# EasyEDA schematic SCH.json
TITLE: Sheet_1; REV: 1.0; Date: 2022-06-12; Sheet: 1/1; Drawn By: tirion; Company: Your Company
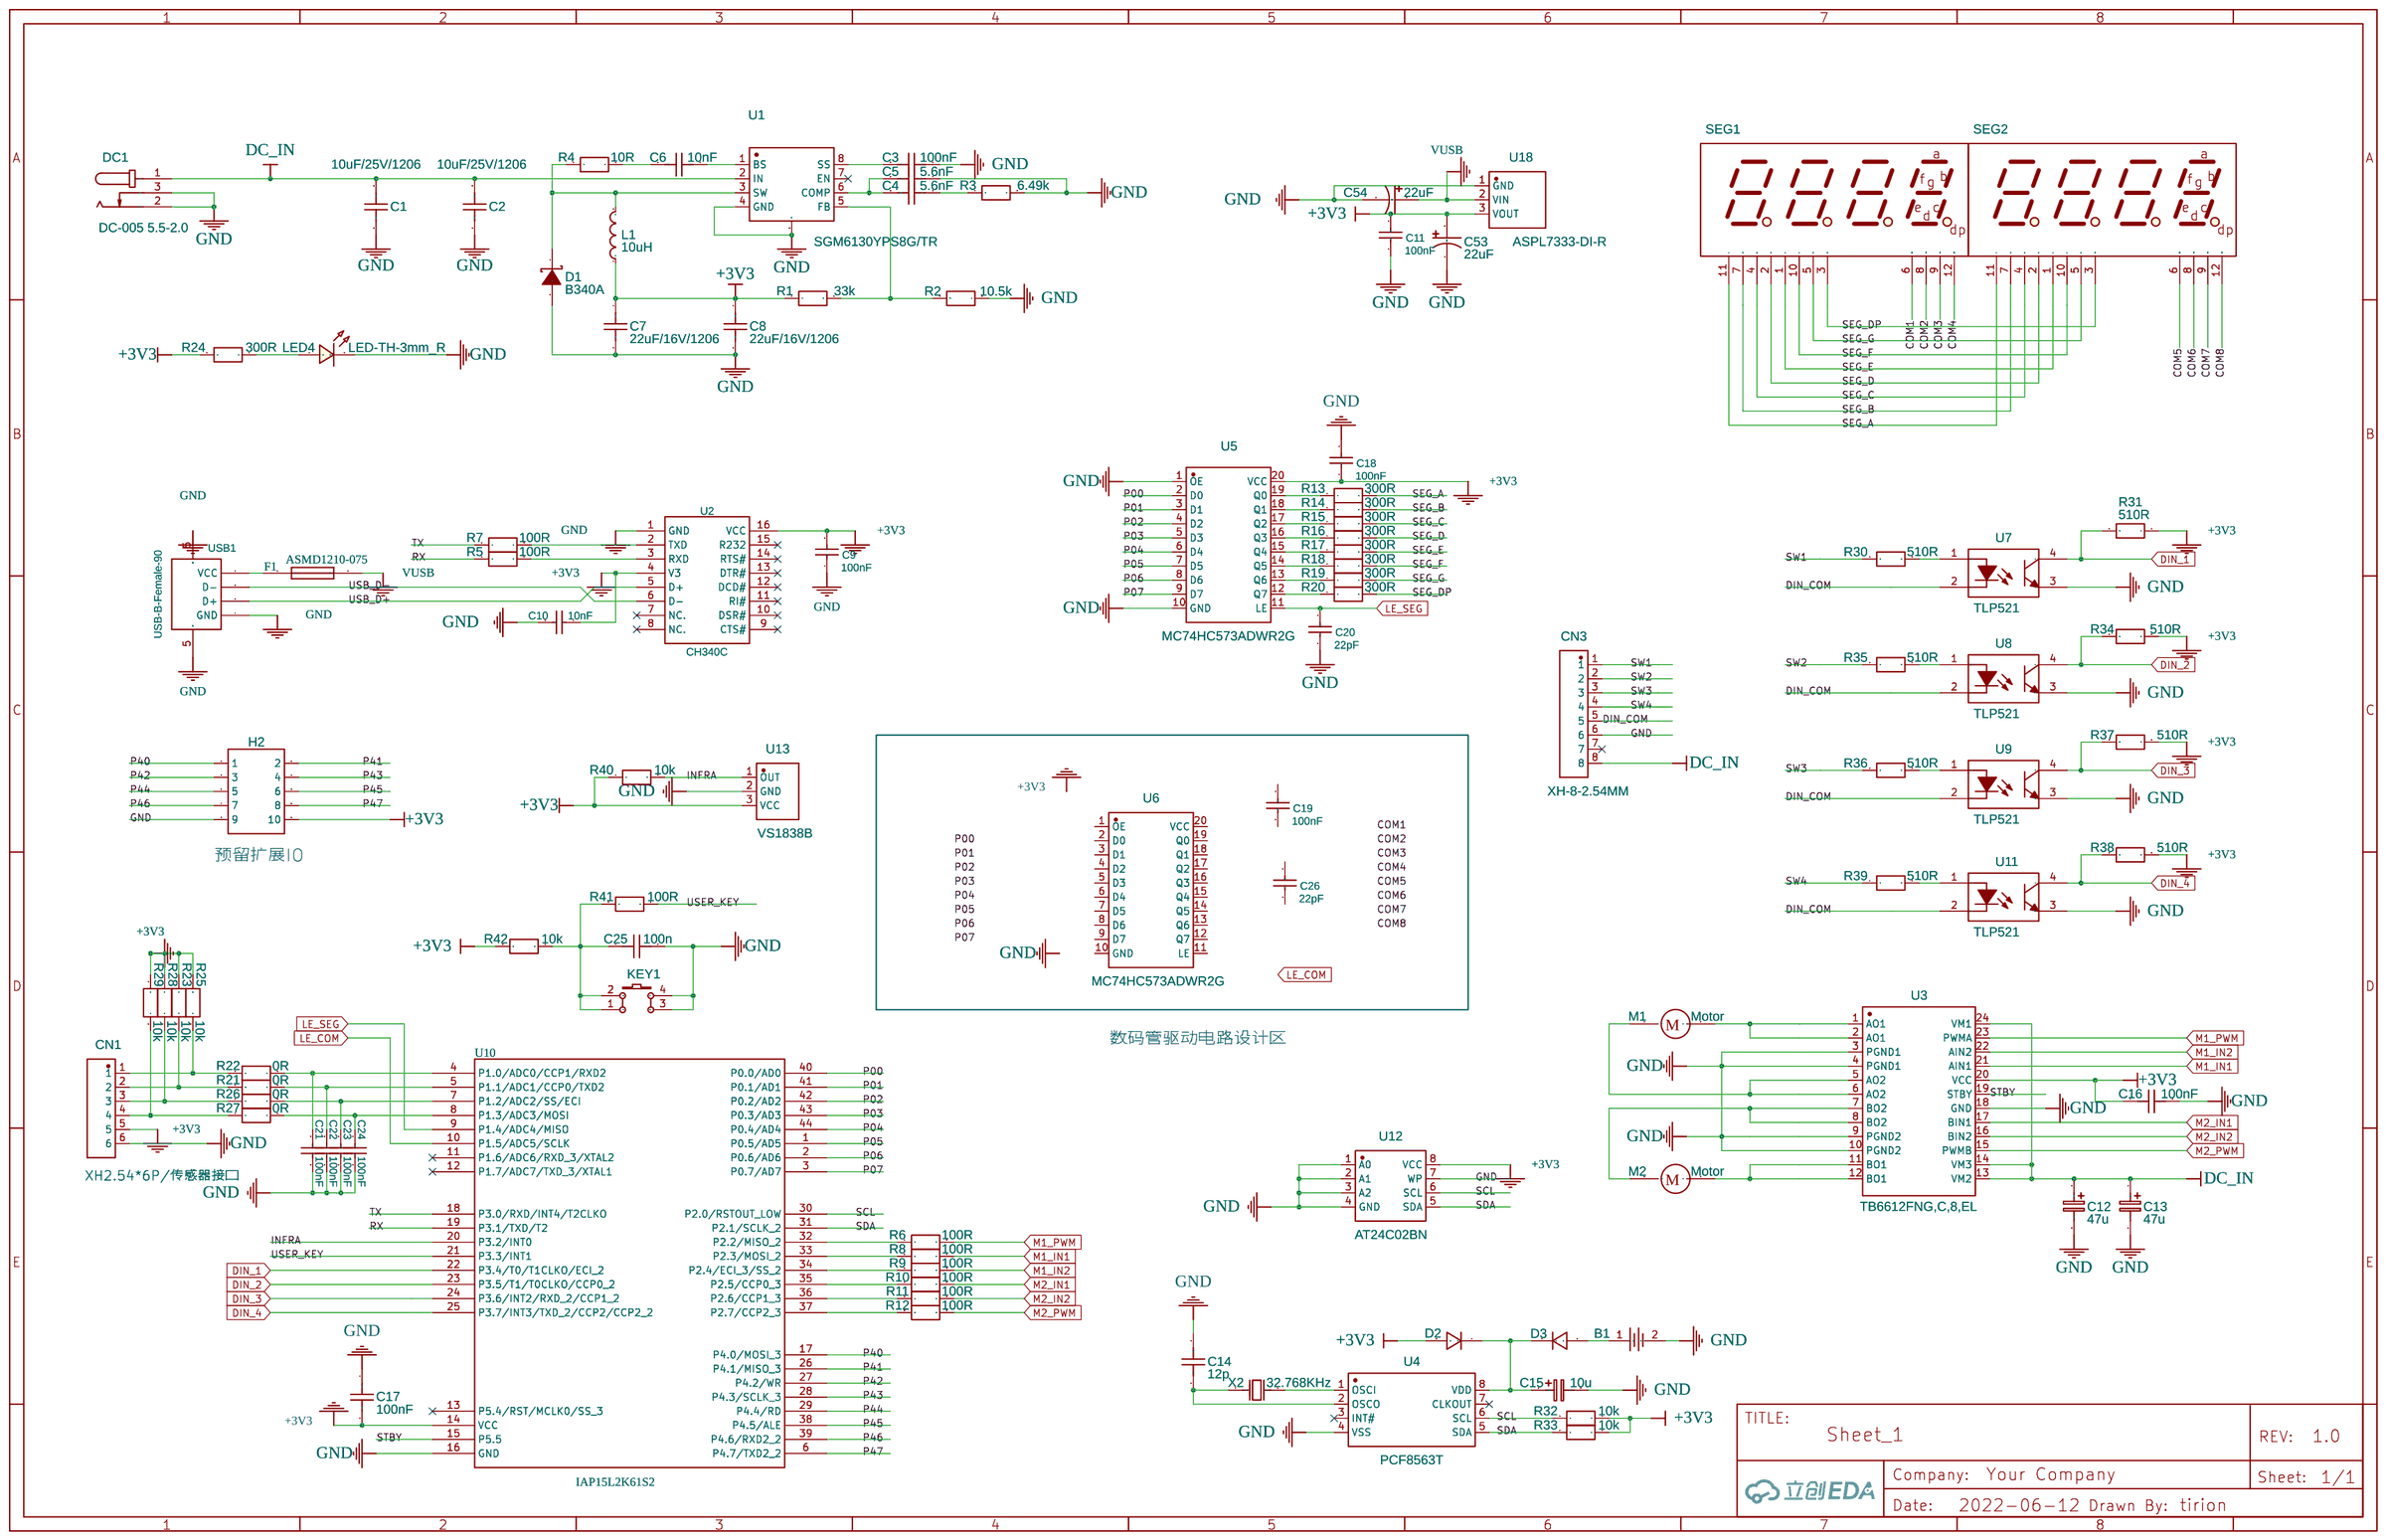
[diagram p0: schematic sheet]

## Parts
B1  CR1220-2  [BAT-SMD_CR1220-2]
C1  10uF/25V/1206  [C1206]
C2  10uF/25V/1206  [C1206]
C3  100nF  [C0805]
C4  5.6nF  [C0805]
C5  5.6nF  [C0805]
C6  10nF  [C0805]
C7  22uF/16V/1206  [C1206]
C8  22uF/16V/1206  [C1206]
C9  100nF  [C_C0805]
C10  10nF  [C_C0805]
C11  100nF  [C_C0805]
C12  47u  [CAP-D6.3×H5.5]
C13  47u  [CAP-D6.3×H5.5]
C14  12p  [C0805]
C15  10u  [CAP-D5.0×H5.5]
C16  100nF  [C0805]
C17  100nF  [C0805]
C18  100nF  [C_C0805]
C19  100nF  [C_C0805]
C20  22pF  [C_C0805]
C21  100nF  [C_C0805]
C22  100nF  [C_C0805]
C23  100nF  [C_C0805]
C24  100nF  [C_C0805]
C25  100n  [C0805]
C26  22pF  [C_C0805]
C53  22uF  [CAP-SMD_BD6.3-L6.6-W6.6-FD]
C54  22uF  [CAP-SMD_BD6.3-L6.6-W6.6-FD]
CN1  XH2.54*6P/传感器接口  [CONN-TH_XH2.54-6P]
CN3  XH-8-2.54MM  [CONN-TH_8P-P2.50-XH2.54-8P]
D1  B340A  [SMA_L4.3-W2.6-LS5.2-RD]
D2  1N4148  [DO-35_BD2.0-L4.2-P8.20-D0.5-RD]
D3  1N4148  [DO-35_BD2.0-L4.2-P8.20-D0.5-RD]
DC1  DC-005 5.5-2.0  [DC-IN-TH_DC005]
F1  ASMD1210-075  [R_R1210]
H2  HDR-F-2.54_2x5  [HDR-F-2.54_2X5]
KEY1  K4-6×6_SMD  [KEY-SMD_4P-L6.0-W6.0-P3.90-LS10.0]
L1  10uH  [IND-SMD_L8.3-W8.3]
LED4  LED-TH-3mm_R  [LED-TH_BD3.0_RED]
M1  Motor  [CONN-TH_2P-P5.08-WJ500V-5.08-2P]
M2  Motor  [CONN-TH_2P-P5.08-WJ500V-5.08-2P]
R1  33k  [R0805]
R2  10.5k  [R0805]
R3  6.49k  [R0805]
R4  10R  [R0805]
R5  100R  [R0805]
R6  100R  [R0805]
R7  100R  [R0805]
R8  100R  [R0805]
R9  100R  [R0805]
R10  100R  [R0805]
R11  100R  [R0805]
R12  100R  [R0805]
R13  300R  [R0805]
R14  300R  [R0805]
R15  300R  [R0805]
R16  300R  [R0805]
R17  300R  [R0805]
R18  300R  [R0805]
R19  300R  [R0805]
R20  300R  [R0805]
R21  0R  [R0805]
R22  0R  [R0805]
R23  10k  [R0805]
R24  300R  [R0805]
R25  10k  [R0805]
R26  0R  [R0805]
R27  0R  [R0805]
R28  10k  [R0805]
R29  10k  [R0805]
R30  510R  [R0805]
R31  510R  [R0805]
R32  10k  [R0805]
R33  10k  [R0805]
R34  510R  [R0805]
R35  510R  [R0805]
R36  510R  [R0805]
R37  510R  [R0805]
R38  510R  [R0805]
R39  510R  [R0805]
R40  10k  [R0805]
R41  100R  [R0805]
R42  10k  [R0805]
SEG1  0.36寸4位数码管  [LED-SEG-TH_FJ5461AH]
SEG2  0.36寸4位数码管  [LED-SEG-TH_FJ5461AH]
U1  SGM6130YPS8G/TR  [SOIC-8_L5.0-W4.0-P1.27-LS6.0-BL-EP2.0]
U2  CH340C  [SOP-16-N]
U3  TB6612FNG,C,8,EL  [SSOP-24_L8.3-W5.6-P0.65-LS7.6-BL]
U4  PCF8563T  [SOIC-8_L5.0-W4.0-P1.27-LS6.0-BL]
U5  MC74HC573ADWR2G  [SOIC-20_L13.0-W7.6-P1.27-LS10.3-BL]
U6  MC74HC573ADWR2G  [SOIC-20_L13.0-W7.6-P1.27-LS10.3-BL]
U7  TLP521  [SOP-4_L6.4-W4.6-P2.54-LS10.2-TL]
U8  TLP521  [SOP-4_L6.4-W4.6-P2.54-LS10.2-TL]
U9  TLP521  [SOP-4_L6.4-W4.6-P2.54-LS10.2-TL]
U10  IAP15L2K61S2  [QFP-LQFP-44]
U11  TLP521  [SOP-4_L6.4-W4.6-P2.54-LS10.2-TL]
U12  AT24C02BN  [SOP-8_L4.9-W3.9-P1.27-LS6.0-TL]
U13  VS1838B  [OPTO-TH_VS1838B]
U18  ASPL7333-DI-R  [SOT-89-3_L4.5-W2.5-P1.50-LS4.2-BR]
USB1  USB-B-Female-90  [S_USB-B]
X2  32.768KHz  [XTAL-DT38]

## Library data of the parts
B1 = CR1220-2: Supplier: LCSC; Manufacturer: Q&J; Supplier Part: C70381; JLCPCB Part Class: Extended Part
C1 C2 = C_1206_US: Contributor: LCEDA_Lib
C3-C8 C14 C16 C17 C25 = C_0805_US: Contributor: LCEDA_Lib
C9-C11 C18-C24 C26 = 0805F104M500NT: Supplier: LCSC; Manufacturer: FH; Supplier Part: C28378
C12 C13 = CE_SMD_D6.3×H5.5_EU: Contributor: LCEDA_Lib; Package Display: No
C15 = CE_SMD_D5.0×H5.5_EU: Contributor: LCEDA_Lib
C53 C54 = CAP-50V22UF: Supplier: LCSC; Supplier Part: C27783; Manufacturer: Honor Elec; Contributor: LCSC
CN1 = XH2.54*6P_直插: Supplier: LCSC; Supplier Part: C9900008614; Manufacturer: null; JLCPCB Part Class: Extended Part; Contributor: LCSC; Package Display: No
CN3 = XH-8-2.54MM: Supplier: LCSC; Supplier Part: C9900005540; JLCPCB Part Class: Extended Part; Contributor: LCSC; Package Display: No
D1 = B340A: Supplier: LCSC; Manufacturer: MDD; Supplier Part: C64982; JLCPCB Part Class: Extended Part
D2 D3 = 1N4148: Supplier: LCSC; Supplier Part: C13769; Manufacturer: STMicroelectronics; Contributor: LCSC
DC1 = dc-005 5.5-2.0: Supplier: LCSC; Supplier Part: C132516; Manufacturer: Shenzhen Cankemeng; Contributor: LCSC; JLCPCB Part Class: Extended Part
F1 = -: Published: 8-Jun-2000; LatestRevisionDate: 17-Jul-2002; LatestRevisionNote: Re-released for DXP Platform.; PackageReference: PIN-W2/E2.8; Publisher: Altium Limited; PackageDescription: Thru-Hole; 2 Leads
H2 = HDR-F-2.54_2x5: Supplier Part: C30419; Supplier: LCSC; Contributor: LCEDA_Lib; Package Display: No
KEY1 = K4-6×6_SMD: Supplier Part: C191626; Supplier: LCSC; Manufacturer: 韩国韩荣; Manufacturer Part: K2-6639SP-D4SC-04; Contributor: LCEDA_Lib
L1 = 1217AS-H-100M=P3: Supplier: LCSC; Supplier Part: C237597; Manufacturer: Murata Electronics; Contributor: LCSC; JLCPCB Part Class: Extended Part
LED4 = LED-TH-3mm_R: Manufacturer: EVERLIGHT(台湾亿光); Manufacturer Part: 204-10SDRD/S530-A3-L; Supplier Part: C84774; Supplier: LCSC; Contributor: LCEDA_Lib
M1 M2 = Motor: Contributor: qiang26; Package Display: No
R1-R42 = R_0805_EU: Contributor: LCEDA_Lib
SEG1 SEG2 = 0.36寸4位数码管: Supplier: LCSC; Manufacturer Part: FJ5461BH 纯红; Manufacturer: ReliaPro; Supplier Part: C38183; Contributor: tirion
U1 = SGM6130YPS8G/TR: Supplier: LCSC; Manufacturer: SGMICRO; Supplier Part: C87094; JLCPCB Part Class: Extended Part
U2 = CH340C: Supplier: LCSC; Manufacturer: WCH; Supplier Part: C84681; LCSC Assembly: Yes; SMT Type: Extend
U3 = TB6612FNG,C,8,EL: Supplier: LCSC; Manufacturer: TOSHIBA; Contributor: LCSC; Supplier Part: C141517; JLCPCB Part Class: Extended Part; Package Display: No
U4 = PCF8563T/5,518: Supplier: LCSC; Manufacturer: NXP; Supplier Part: C7440; JLCPCB Part Class: Basic Part
U5 U6 = MC74HC573ADWR2G: Supplier: LCSC; Supplier Part: C233618; Manufacturer: ON Semicon; Contributor: LCSC; JLCPCB Part Class: Extended Part; Package Display: No
U7-U9 U11 = TLP521: Supplier: LCSC; Supplier Part: C9900005355; Manufacturer: null; link: https://atta.szlcsc.comnull; JLCPCB Part Class: Extended Part; Contributor: lcsc; Package Display: No
U10 = -: ________: STC15ϵ_е_Ƭ__
U12 = AT24C02BN: Supplier: LCSC; Supplier Part: C9900013198; Manufacturer: null; JLCPCB Part Class: Extended Part; Contributor: lcsc; Package Display: No
U13 = VS1838B: Supplier: LCSC; Supplier Part: C9900002107; Manufacturer: null; JLCPCB Part Class: Extended Part; Contributor: LCSC; Package Display: No
U18 = ASPL7333-DI-R: Supplier: LCSC; Supplier Part: C2758205; Manufacturer: Ascend(安森德); Contributor: LCSC; JLCPCB Part Class: Extended Part
USB1 = USB-B-Female-90: Supplier: LCSC; Manufacturer: ValuePro; Manufacturer Part: USB-BF90; image: //image.lceda.cn/szlcsc/C46392.jpg; Supplier Part: C46392
X2 = 6K832768F12UB: Supplier: LCSC; Supplier Part: C252404; Manufacturer: SHENZHEN CRYSTAL TECH; Contributor: tirion

## Nets
+3V3: C7.1 C8.1 C9.2 C10.1 C11.2 C16.1 C17.2 C18.1 C53.1 CN1.5 D2.2 H2.10 L1.1 R1.1 R23.1 R24.2 R25.1 R28.1 R29.1 R31.1 R32.2 R33.2 R34.1 R37.1 R38.1 R40.1 R42.2 U2.4(V3) U2.16(VCC) U3.20(VCC) U5.20(VCC) U10.14(VCC) U12.8(VCC) U13.3(VCC) U18.3(VOUT)
GND: B1.2 C1.1 C2.1 C3.1 C5.1 C7.2 C8.2 C9.1 C10.2 C11.1 C12.2 C13.2 C14.1 C15.2 C16.2 C17.1 C18.2 C20.1 C21.2 C22.2 C23.2 C24.2 C25.2 C53.2 C54.2 CN1.6 CN3.6 D1.2(A) DC1.2 DC1.3 H2.9 KEY1.3 KEY1.4 LED4.2 R2.1 R3.2 U1.4(GND) U1.9 U2.1(GND) U3.3(PGND1) U3.4(PGND1) U3.9(PGND2) U3.10(PGND2) U3.18(GND) U4.4(VSS) U5.1(OE) U5.10(GND) U7.3 U8.3 U9.3 U10.16(GND) U11.3 U12.1(A0) U12.2(A1) U12.3(A2) U12.4(GND) U12.7(WP) U13.2(GND) U18.1(GND) USB1.4(GND) USB1.5(SH2)
COM1: SEG1.6(DIG4)
COM2: SEG1.8(DIG3)
COM3: SEG1.9(DIG2)
COM4: SEG1.12(DIG1)
COM5: SEG2.6(DIG4)
COM6: SEG2.8(DIG3)
COM7: SEG2.9(DIG2)
COM8: SEG2.12(DIG1)
DC_IN: C1.2 C2.2 C12.1 C13.1 CN3.8 DC1.1 U1.2(IN) U3.13(VM2) U3.14(VM3) U3.24(VM1)
DIN_1: R31.2 U7.4 U10.22(P3.4/T0/T1CLKO/ECI_2)
DIN_2: R34.2 U8.4 U10.23(P3.5/T1/T0CLKO/CCP0_2)
DIN_3: R37.2 U9.4 U10.24(P3.6/INT2/RXD_2/CCP1_2)
DIN_4: R38.2 U10.25(P3.7/INT3/TXD_2/CCP2/CCP2_2) U11.4
DIN_COM: CN3.5 U7.2 U8.2 U9.2 U11.2
INFRA: R40.2 U10.20(P3.2/INT0) U13.1(OUT)
LE_COM: U10.10(P1.5/ADC5/SCLK)
LE_SEG: C20.2 U5.11(LE) U10.9(P1.4/ADC4/MISO)
M1_IN1: R8.2 U3.21(AIN1)
M1_IN2: R9.2 U3.22(AIN2)
M1_PWM: R6.2 U3.23(PWMA)
M2_IN1: R10.2 U3.17(BIN1)
M2_IN2: R11.2 U3.16(BIN2)
M2_PWM: R12.2 U3.15(PWMB)
P00: U5.2(D0) U10.40(P0.0/AD0)
P01: U5.3(D1) U10.41(P0.1/AD1)
P02: U5.4(D2) U10.42(P0.2/AD2)
P03: U5.5(D3) U10.43(P0.3/AD3)
P04: U5.6(D4) U10.44(P0.4/AD4)
P05: U5.7(D5) U10.1(P0.5/AD5)
P06: U5.8(D6) U10.2(P0.6/AD6)
P07: U5.9(D7) U10.3(P0.7/AD7)
P40: H2.1 U10.17(P4.0/MOSI_3)
P41: H2.2 U10.26(P4.1/MISO_3)
P42: H2.3 U10.27(P4.2/WR)
P43: H2.4 U10.28(P4.3/SCLK_3)
P44: H2.5 U10.29(P4.4/RD)
P45: H2.6 U10.38(P4.5/ALE)
P46: H2.7 U10.39(P4.6/RXD2_2)
P47: H2.8 U10.6(P4.7/TXD2_2)
RX: R5.1 U10.19(P3.1/TXD/T2)
SCL: R32.1 U4.6(SCL) U10.30(P2.0/RSTOUT_LOW) U12.6(SCL)
SDA: R33.1 U4.5(SDA) U10.31(P2.1/SCLK_2) U12.5(SDA)
SEG_A: R13.2 SEG1.11(A) SEG2.11(A)
SEG_B: R14.2 SEG1.7(B) SEG2.7(B)
SEG_C: R15.2 SEG1.4(C) SEG2.4(C)
SEG_D: R16.2 SEG1.2(D) SEG2.2(D)
SEG_DP: R20.2 SEG1.3(DP) SEG2.3(DP)
SEG_E: R17.2 SEG1.1(E) SEG2.1(E)
SEG_F: R18.2 SEG1.10(F) SEG2.10(F)
SEG_G: R19.2 SEG1.5(G) SEG2.5(G)
STBY: U3.19(STBY) U10.15(P5.5)
SW1: CN3.1 R30.1
SW2: CN3.2 R35.1
SW3: CN3.3 R36.1
SW4: CN3.4 R39.1
TX: R7.1 U10.18(P3.0/RXD/INT4/T2CLKO)
USB_D+: U2.5(D+) USB1.3(D+)
USB_D-: U2.6(D-) USB1.2(D-)
USER_KEY: R41.1 U10.21(P3.3/INT1)
VUSB: C54.1 F1.2 U18.2(VIN)
Net-(B1-1): B1.1 D3.2
Net-(C3-2): C3.2 U1.8(SS)
Net-(C4-1): C4.1 R3.1
Net-(C4-2): C4.2 C5.2 U1.6(COMP)
Net-(C6-1): C6.1 U1.1(BS)
Net-(C6-2): C6.2 R4.2
Net-(C14-2): C14.2 U4.2(OSCO) X2.1(OSC1)
Net-(C15-1): C15.1 D2.1 D3.1 U4.8(VDD)
Net-(C21-1): C21.1 R22.2 U10.4(P1.0/ADC0/CCP1/RXD2)
Net-(C22-1): C22.1 R21.2 U10.5(P1.1/ADC1/CCP0/TXD2)
Net-(C23-1): C23.1 R26.2 U10.7(P1.2/ADC2/SS/ECI)
Net-(C24-1): C24.1 R27.2 U10.8(P1.3/ADC3/MOSI)
Net-(C25-1): C25.1 KEY1.1 KEY1.2 R41.2 R42.1
Net-(CN1-1): CN1.1 R22.1 R25.2
Net-(CN1-2): CN1.2 R21.1 R23.2
Net-(CN1-3): CN1.3 R26.1 R28.2
Net-(CN1-4): CN1.4 R27.1 R29.2
Net-(D1-1): D1.1(K) L1.2 R4.1 U1.3(SW)
Net-(F1-1): F1.1 USB1.1(VCC)
Net-(LED4-1): LED4.1 R24.1
Net-(M1-1): M1.1 U3.1(AO1) U3.2(AO1)
Net-(M1-2): M1.2 U3.5(AO2) U3.6(AO2)
Net-(M2-1): M2.1 U3.11(BO1) U3.12(BO1)
Net-(M2-2): M2.2 U3.7(BO2) U3.8(BO2)
Net-(R1-2): R1.2 R2.2 U1.5(FB)
Net-(R5-2): R5.2 U2.3(RXD)
Net-(R6-1): R6.1 U10.32(P2.2/MISO_2)
Net-(R7-2): R7.2 U2.2(TXD)
Net-(R8-1): R8.1 U10.33(P2.3/MOSI_2)
Net-(R9-1): R9.1 U10.34(P2.4/ECI_3/SS_2)
Net-(R10-1): R10.1 U10.35(P2.5/CCP0_3)
Net-(R11-1): R11.1 U10.36(P2.6/CCP1_3)
Net-(R12-1): R12.1 U10.37(P2.7/CCP2_3)
Net-(R13-1): R13.1 U5.19(Q0)
Net-(R14-1): R14.1 U5.18(Q1)
Net-(R15-1): R15.1 U5.17(Q2)
Net-(R16-1): R16.1 U5.16(Q3)
Net-(R17-1): R17.1 U5.15(Q4)
Net-(R18-1): R18.1 U5.14(Q5)
Net-(R19-1): R19.1 U5.13(Q6)
Net-(R20-1): R20.1 U5.12(Q7)
Net-(R30-2): R30.2 U7.1
Net-(R35-2): R35.2 U8.1
Net-(R36-2): R36.2 U9.1
Net-(R39-2): R39.2 U11.1
Net-(U4-1): U4.1(OSCI) X2.2(OSC2)

Not connected (* = marked no-connect by the designer): C19 1 2; C26 1 2; CN3 7*; U1 7(EN)*; U2 7(NC.)* 8(NC.)* 9(CTS#)* 10(DSR#)* 11(RI#)* 12(DCD#)* 13(DTR#)* 14(RTS#)* 15(R232)*; U4 3(INT#)* 7(CLKOUT)*; U6 1(OE) 2(D0) 3(D1) 4(D2) 5(D3) 6(D4) 7(D5) 8(D6) 9(D7) 10(GND) 11(LE) 12(Q7) 13(Q6) 14(Q5) 15(Q4) 16(Q3) 17(Q2) 18(Q1) 19(Q0) 20(VCC); U10 11(P1.6/ADC6/RXD_3/XTAL2)* 12(P1.7/ADC7/TXD_3/XTAL1)* 13(P5.4/RST/MCLK0/SS_3)*

## Notes on the sheet
- 预留扩展IO
- 数码管驱动电路设计区
